# Altium schematic sheet CLK_INPUT.SchDoc: Clock distribution
size 420 x 297 mm; Author: G.K.; CompanyName: WUT; DrawnBy: G.K.; Organization: WUT ISE; Address1: Warsaw Univeristy of Technology; Address2: Nowowiejska 15/19; DocumentNumber: 6; Revision: -; SheetNumber: 6; SheetTotal: 7; EDA_Number: ARTIQ; Projet: ARTIQ/SINARA; ModifiedBy: -; CreateDate: XX/XX/XXXX; CheckedDate: -; Title2: and generation; DivGrp: ISE; Designer: G.K.; ModifiedDate: -; ProjectName: ARTIQ/SINARA
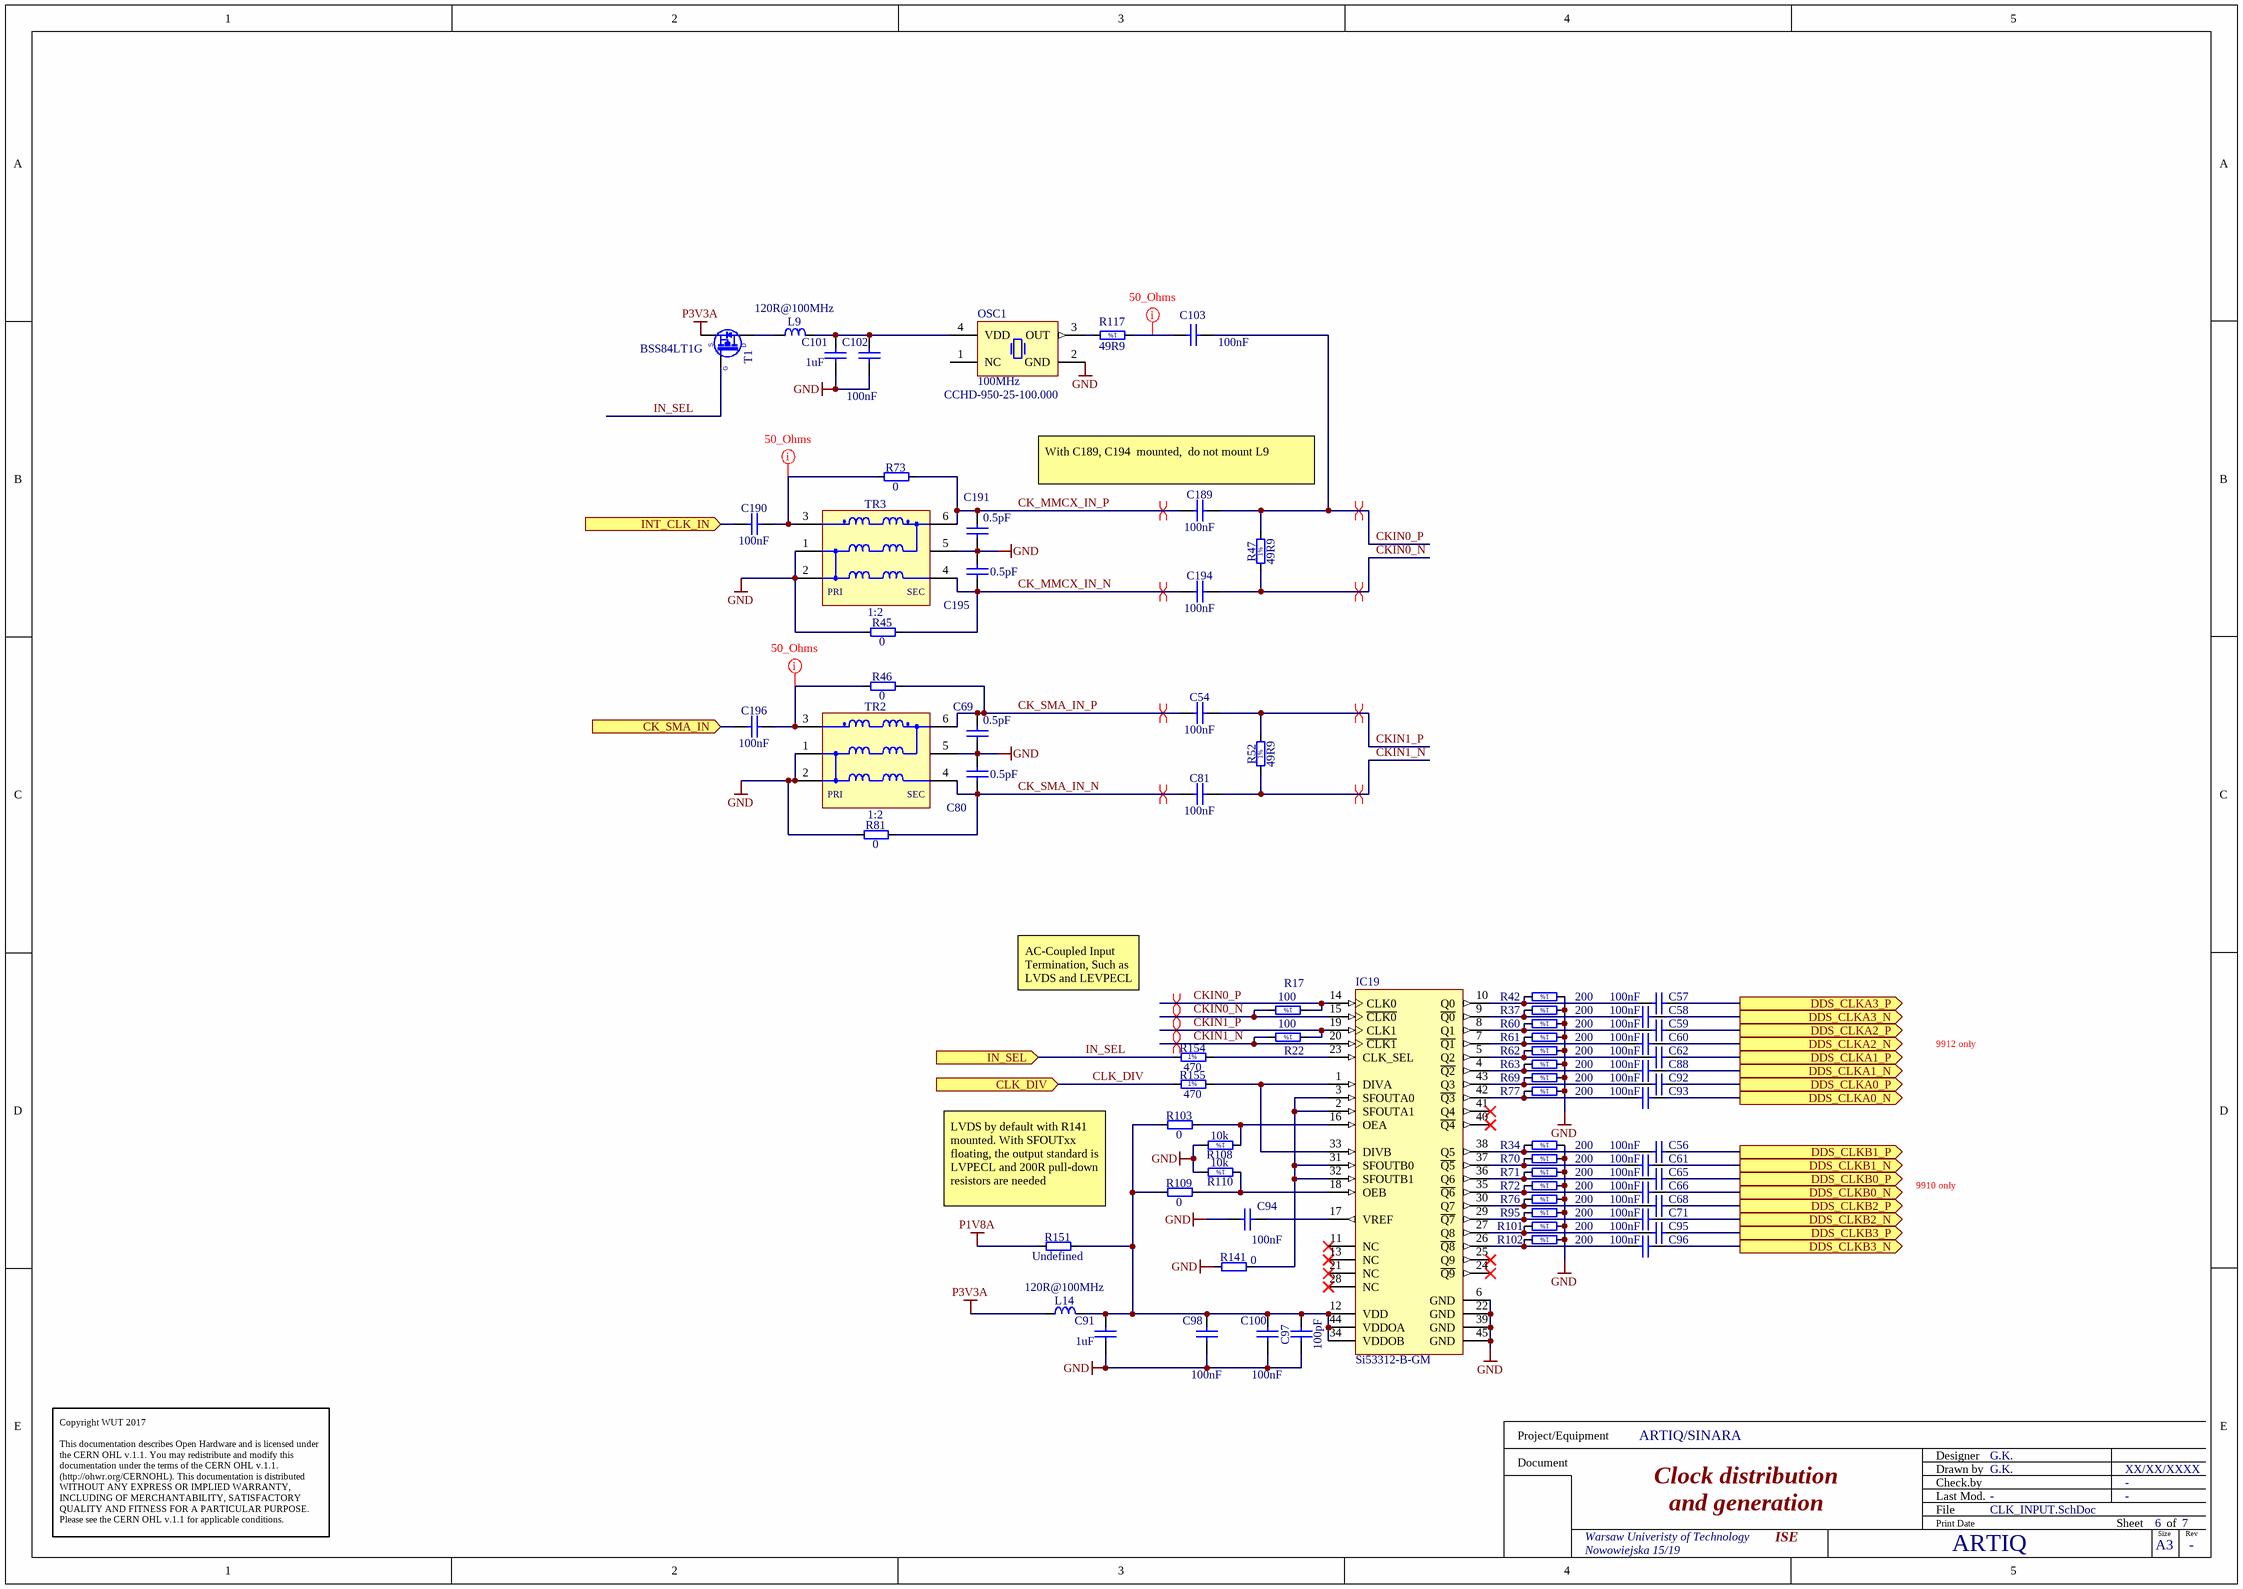
[diagram p0: CLK_INPUT.SchDoc]

## Parts
C54  100nF  [CAPC1005X55N]
C56  100nF  [CAPC1005X55N]
C57  100nF  [CAPC1005X55N]
C58  100nF  [CAPC1005X55N]
C59  100nF  [CAPC1005X55N]
C60  100nF  [CAPC1005X55N]
C61  100nF  [CAPC1005X55N]
C62  100nF  [CAPC1005X55N]
C65  100nF  [CAPC1005X55N]
C66  100nF  [CAPC1005X55N]
C68  100nF  [CAPC1005X55N]
C69  0.5pF  [CAPC1005X50N]
C71  100nF  [CAPC1005X55N]
C80  0.5pF  [CAPC1005X50N]
C81  100nF  [CAPC1005X55N]
C88  100nF  [CAPC1005X55N]
C91  1uF  [CAPC1005X55N]
C92  100nF  [CAPC1005X55N]
C93  100nF  [CAPC1005X55N]
C94  100nF  [CAPC1005X55N]
C95  100nF  [CAPC1005X55N]
C96  100nF  [CAPC1005X55N]
C97  100pF  [CAPC1005X55N]
C98  100nF  [CAPC1005X55N]
C100  100nF  [CAPC1005X55N]
C101  1uF  [CAPC1005X55N]
C102  100nF  [CAPC1005X55N]
C103  100nF  [CAPC1005X55N]
C189  100nF  [CAPC1005X55N]
C190  100nF  [CAPC1005X55N]
C191  0.5pF  [CAPC1005X50N]
C194  100nF  [CAPC1005X55N]
C195  0.5pF  [CAPC1005X50N]
C196  100nF  [CAPC1005X55N]
IC19  Si53312-B-GM  [SLAB-QFN-44-2800x2800TP_N]
L9  120R@100MHz  [INDC1608X95N]
L14  120R@100MHz  [INDC1608X95N]
OSC1  100MHz  Manufacturer Part Number: CCHD-950-25-100.000  [OSC_CRYSTEK_CCHD-950]
R17  100  [RESC1005X40N]
R22  100  [RESC1005X40N]
R34  200  [RESC1005X40N]
R37  200  [RESC1005X40N]
R42  200  [RESC1005X40N]
R45  0  [RESC1005X40N]
R46  0  [RESC1005X40N]
R47  49R9  [RESC1005X40N]
R52  49R9  [RESC1005X40N]
R60  200  [RESC1005X40N]
R61  200  [RESC1005X40N]
R62  200  [RESC1005X40N]
R63  200  [RESC1005X40N]
R69  200  [RESC1005X40N]
R70  200  [RESC1005X40N]
R71  200  [RESC1005X40N]
R72  200  [RESC1005X40N]
R73  0  [RESC1005X40N]
R76  200  [RESC1005X40N]
R77  200  [RESC1005X40N]
R81  0  [RESC1005X40N]
R95  200  [RESC1005X40N]
R101  200  [RESC1005X40N]
R102  200  [RESC1005X40N]
R103  0  [RESC1608X55N]
R108  10k  [RESC1005X40N]
R109  0  [RESC1608X55N]
R110  10k  [RESC1005X40N]
R117  49R9  [RESC1005X40N]
R141  0  [RESC1608X55N]
R151  Undefined  [RESC1608X55N]
R154  470  [RESC1005X40N]
R155  470  [RESC1005X40N]
T1  BSS84LT1G  [SOT95P240X110-3N]
TR2  1:2  [XFMR_MINI-CIRCUITS_DB1627]
TR3  1:2  [XFMR_MINI-CIRCUITS_DB1627]

## Ports
CK_SMA_IN (in), CLK_DIV (in), DDS_CLKA0_N (out), DDS_CLKA0_P (out), DDS_CLKA1_N (out), DDS_CLKA1_P (out), DDS_CLKA2_N (out), DDS_CLKA2_P (out), DDS_CLKA3_N (out), DDS_CLKA3_P (out), DDS_CLKB0_N (out), DDS_CLKB0_P (out), DDS_CLKB1_N (out), DDS_CLKB1_P (out), DDS_CLKB2_N (out), DDS_CLKB2_P (out), DDS_CLKB3_N (out), DDS_CLKB3_P (out), IN_SEL (in), INT_CLK_IN (in)

## Nets
GND: C69.1 C80.2 C91.1 C94.1 C97.1 C98.1 C100.1 C101.1 C102.1 C191.1 C195.2 IC19.6(GND) IC19.22(GND) IC19.39(GND) IC19.45(GND) OSC1.2(GND) R34.1 R37.1 R42.1 R45.1 R60.1 R61.1 R62.1 R63.1 R69.1 R70.1 R71.1 R72.1 R76.1 R77.1 R81.1 R95.1 R101.1 R102.1 R108.2 R110.2 R141.1 TR2.1(P1) TR2.2(P1) TR2.5(NC) TR3.1(P1) TR3.2(P1) TR3.5(NC)
P1V8A: R151.1
P3V3A: L14.2 T1.2(S)
CK_MMCX_IN_N: C194.1 C195.1 R45.2 TR3.4(S1)
CK_MMCX_IN_P: C189.1 C191.2 R73.2 TR3.6(S1)
CK_SMA_IN: C196.1 ; port CK_SMA_IN
CK_SMA_IN_N: C80.1 C81.1 R81.2 TR2.4(S1)
CK_SMA_IN_P: C54.1 C69.2 R46.2 TR2.6(S1)
CKIN0_N: C194.2 IC19.15(~{CLK0}) R17.2 R47.1
CKIN0_P: C103.1 C189.2 IC19.14(CLK0) R17.1 R47.2
CKIN1_N: C81.2 IC19.20(~{CLK1}) R22.2 R52.1
CKIN1_P: C54.2 IC19.19(CLK1) R22.1 R52.2
CLK_DIV: R155.1 ; port CLK_DIV
DDS_CLKA0_N: C93.1 ; port DDS_CLKA0_N
DDS_CLKA0_P: C92.1 ; port DDS_CLKA0_P
DDS_CLKA1_N: C88.1 ; port DDS_CLKA1_N
DDS_CLKA1_P: C62.1 ; port DDS_CLKA1_P
DDS_CLKA2_N: C60.1 ; port DDS_CLKA2_N
DDS_CLKA2_P: C59.1 ; port DDS_CLKA2_P
DDS_CLKA3_N: C58.1 ; port DDS_CLKA3_N
DDS_CLKA3_P: C57.1 ; port DDS_CLKA3_P
DDS_CLKB0_N: C66.1 ; port DDS_CLKB0_N
DDS_CLKB0_P: C65.1 ; port DDS_CLKB0_P
DDS_CLKB1_N: C61.1 ; port DDS_CLKB1_N
DDS_CLKB1_P: C56.1 ; port DDS_CLKB1_P
DDS_CLKB2_N: C71.1 ; port DDS_CLKB2_N
DDS_CLKB2_P: C68.1 ; port DDS_CLKB2_P
DDS_CLKB3_N: C96.1 ; port DDS_CLKB3_N
DDS_CLKB3_P: C95.1 ; port DDS_CLKB3_P
IN_SEL: R154.1 T1.1(G) ; port IN_SEL
INT_CLK_IN: C190.1 ; port INT_CLK_IN
NetC56_2: C56.2 IC19.38(Q5) R34.2
NetC57_2: C57.2 IC19.10(Q0) R42.2
NetC58_2: C58.2 IC19.9(~{Q0}) R37.2
NetC59_2: C59.2 IC19.8(Q1) R60.2
NetC60_2: C60.2 IC19.7(~{Q1}) R61.2
NetC61_2: C61.2 IC19.37(~{Q5}) R70.2
NetC62_2: C62.2 IC19.5(Q2) R62.2
NetC65_2: C65.2 IC19.36(Q6) R71.2
NetC66_2: C66.2 IC19.35(~{Q6}) R72.2
NetC68_2: C68.2 IC19.30(Q7) R76.2
NetC71_2: C71.2 IC19.29(~{Q7}) R95.2
NetC88_2: C88.2 IC19.4(~{Q2}) R63.2
NetC91_2: C91.2 C97.2 C98.2 C100.2 IC19.12(VDD) IC19.34(VDDOB) IC19.44(VDDOA) L14.1 R103.1 R109.1 R151.2
NetC92_2: C92.2 IC19.43(Q3) R69.2
NetC93_2: C93.2 IC19.42(~{Q3}) R77.2
NetC94_2: C94.2 IC19.17(VREF)
NetC95_2: C95.2 IC19.27(Q8) R101.2
NetC96_2: C96.2 IC19.26(~{Q8}) R102.2
NetC101_2: C101.2 C102.2 L9.1 OSC1.4(VDD)
NetC103_2: C103.2 R117.1
NetC190_2: C190.2 R73.1 TR3.3(P1)
NetC196_2: C196.2 R46.1 TR2.3(P1)
NetIC19_1: IC19.1(DIVA) IC19.33(DIVB) R155.2
NetIC19_2: IC19.2(SFOUTA1) IC19.3(SFOUTA0) IC19.31(SFOUTB0) IC19.32(SFOUTB1) R141.2
NetIC19_16: IC19.16(OEA) R103.2 R108.1
NetIC19_18: IC19.18(OEB) R109.2 R110.1
NetIC19_23: IC19.23(CLK_SEL) R154.2
NetL9_2: L9.2 T1.3(D)
NetOSC1_3: OSC1.3(OUT) R117.2

Not connected (* = marked no-connect by the designer): IC19 11(NC)* 13(NC)* 21(NC)* 24(~{Q9})* 25(Q9)* 28(NC)* 40(~{Q4})* 41(Q4)*; OSC1 1(NC)

## Layout directives
differential pair: CK_MMCX_IN_N, CK_MMCX_IN_P, CK_SMA_IN_N, CK_SMA_IN_P, CKIN0_N, CKIN0_P, CKIN1_N, CKIN1_P
net class 50_Ohms: NetC103_2, NetC190_2, NetC196_2

## Notes on the sheet
- (near C189) With C189, C194  mounted,  do not mount L9
- AC-Coupled Input Termination, Such as LVDS and LEVPECL
- 9912 only
- LVDS by default with R141 mounted. With SFOUTxx floating, the output standard is LVPECL and 200R pull-down resistors are needed
- 9910 only
- Copyright WUT 2017
  This documentation describes Open Hardware and is licensed under the CERN OHL v.1.1. You may redistribute and modify this documentation under the terms of the CERN OHL v.1.1. (http://ohwr.org/CERNOHL). This documentation is distributed WITHOUT ANY EXPRESS OR IMPLIED WARRANTY, INCLUDING OF MERCHANTABILITY, SATISFACTORY QUALITY AND FITNESS FOR A PARTICULAR PURPOSE. Please see the CERN OHL v.1.1 for applicable conditions.
- Project/Equipment
- Document
- Designer
- Drawn by
- Check.by
- File
- Last Mod.
- Print Date
- Sheet
- Size
- A3
- of
- Rev
- (in symbol R0402_10K_1%_0.0625W_100PPM) 1%
- (in symbol R0402_49R9_1%_0.0625W_100PPM) 1%
- (in symbol R0402_100R_1%_0.0625W_100PPM) 1%
- (in symbol R0402_200R_1%_0.0625W_100PPM) 1%
- (in symbol R0402_470R_1%_0.0625W_100PPM) 1%
- (in symbol XFMR_MINI-CIRCUITS_TCM2-43X+) PRI; SEC

## Library data of the parts
C54 C56-C62 C65 C66 C68 C71 C81 C88 C92-C96 C98 C100 C102 C103 C189 C190 C194 C196 = CC0402_100NF_16V_10%_X5R: Non-polarised capacitor; Part Description: SMD Multilayer Chip Ceramic Capacitor; Manufacturer: GENERIC; Manufacturer1 Part Number: GRM155R61C104KA88D; Voltage: 16V; TC: X5R; Tolerance: ±10%; Part Number: CC0402_100NF_16V_10%_X5R; Component Kind: Standard; Component Type: Standard; Pin Count: 2; Value: 100nF; Status: None; Manufacturer Part Number: CC0402_100NF_16V_10%_X5R; Case: 0402; Mounted: Yes; Socket: No; SMD: Yes; Sense: No; Manufacturer1 Example: MURATA; Manufacturer1 ComponentHeight: 0.55mm; HelpURL: \\cern.ch\dfs\Applications\Altium\Datasheets\CC0402_X5R_MURATA_GRM.pdf; Author: CERN DEM JLC; CreateDate: 10.12.2013; LatestRevisionDate: 10.12.2013
C69 C80 C191 C195 = CC0402_0.5PF_25V_0.05PF_AVX_04023J0R5ABSTR: Non-polarised capacitor; Part Description: Thin-Film Chip Capacitors for RF Signal and Power Applications, Accu-P Series; Manufacturer: AVX; Voltage: 25V; Tolerance: ±0.05pF; Part Number: CC0402_0.5PF_25V_0.05PF_AVX_04023J0R5ABSTR; Component Kind: Standard; Component Type: Standard; Pin Count: 2; Value: 0.5pF; Status: None; Manufacturer Part Number: 04023J0R5ABSTR; Case: 0402; Mounted: Yes; Socket: No; SMD: Yes; Sense: No; ComponentHeight: 0.5mm; HelpURL: \\cern.ch\dfs\Applications\Altium\Datasheets\CC0402_AVX_ACCU-P.pdf; Author: CERN DEM JLC; CreateDate: 2017-02-22; LatestRevisionDate: 2017-02-22
C91 C101 = CC0402_1UF_16V_10%_X5R: Non-polarised capacitor; Part Description: SMD Multilayer Chip Ceramic Capacitor; Manufacturer: GENERIC; Manufacturer1 Part Number: C1005X5R1C105KT; Voltage: 16V; TC: X5R; Tolerance: ±10%; Part Number: CC0402_1UF_16V_10%_X5R; Component Kind: Standard; Component Type: Standard; Pin Count: 2; Value: 1uF; Status: Preferred; Manufacturer Part Number: CC0402_1UF_16V_10%_X5R; Case: 0402; Mounted: Yes; Socket: No; SMD: Yes; Sense: No; Manufacturer1 Example: TDK; Manufacturer1 ComponentHeight: 0.55mm; HelpURL: \\cern.ch\dfs\Applications\Altium\Datasheets\CC0402_X5R_TDK_C.pdf; Author: CERN DEM JLC; CreateDate: 2012-10-25; LatestRevisionDate: 2012-10-25
C97 = CC0402_100PF_50V_5%_C0G: Non-polarised capacitor; Part Description: SMD Multilayer Chip Ceramic Capacitor; Manufacturer: GENERIC; Manufacturer1 Part Number: C0402C101J5GACTU; Voltage: 50V; TC: C0G/NP0; Tolerance: ±5%; Part Number: CC0402_100PF_50V_5%_C0G; Component Kind: Standard; Component Type: Standard; Pin Count: 2; Value: 100pF; Status: Preferred; Manufacturer Part Number: CC0402_100PF_50V_5%_C0G; Case: 0402; Mounted: Yes; Socket: No; SMD: Yes; Sense: No; Manufacturer1 Example: KEMET; Manufacturer1 ComponentHeight: 0.55mm; HelpURL: \\cern.ch\dfs\Applications\Altium\Datasheets\CC0805_C0G_KEMET_(Commercial Grade).pdf; Author: CERN DEM JLC; CreateDate: 03.12.2007; LatestRevisionDate: 22.04.2015
IC19 = CMP-0510-00356-1: 1:10 Low Jitter Universal Buffer / Level Translator with 2:1 Input Mux, 1 to 1250 MHz, -40 to 85 degC, 44-pin QFN; Manufacturer: Silicon Labs; Output Format: LVPECL; LVDS; CML; HCSL; LVCMOS; Sub-Family: Clock Buffers; PartNumber: Si53312-B-GM; ComponentLink2URL: http://www.silabs.com/Support%20Documents/TechnicalDocs/Si53312.pdf; ComponentLink1URL: http://www.silabs.com/; ComponentLink3URL: http://www.silabs.com/Support%20Documents/TechnicalDocs/Si53302.pdf; ComponentLink1Description: Manufacturer URL; Code_IPC: J-STD-020; Frequency (MHz): 1 to 1250; ComponentLink2Description: Datasheet; ComponentLink3Description: Package Specification; Code_JEDEC: MO-220; Mounting Technology: Surface Mount; PackageDescription: 44-Pin Quad-Flat No-Leads Package, Body 7 x 7 mm, Pitch 0.5 mm; DatasheetVersion: Rev. 0.4; PackageReference: QFN-44
L9 L14 = IND0603_MURATA_BLM18PG121SN1D: Inductor; Part Description: SMD EMIFIL Chip Ferrite Bead; Manufacturer: MURATA; Power: 2A; Resistance: 0.05R; Part Number: IND0603_MURATA_BLM18PG121SN1D; Component Kind: Standard; Component Type: Standard; Pin Count: 2; Value: 120R@100MHz; Status: None; Manufacturer Part Number: BLM18PG121SN1D; Case: 0603; Mounted: Yes; Socket: No; SMD: Yes; Sense: No; ComponentHeight: 0.95mm; HelpURL: \\cern.ch\dfs\Applications\Altium\Datasheets\IND0603_MURATA_BLM18P.pdf; Author: CERN DEM BC; CreateDate: 2015-07-27; LatestRevisionDate: 2015-07-27
OSC1 = OSC_CCHD-950: 100MHz low noise oscillator; Part Number: OSC_100MHZ_CRYSTEK_CCHD-950-25-100.000; Part Description: 3.3V, ±25ppm, 0..70°C, CMOS Surface Mount Ultra-Low Noise Oscillator (CCHD-950 Series); Manufacturer: CRYSTEK CRYSTAL; PressFit: No; Bonding: No; Component Kind: Standard; Component Type: Standard; PackageDescription: Oscillator, 5.08mm Pitch; 4 Pin, 14.2mm L X 9.14mm W X 5.3mm H, CCHD-950 Serie; Value: 100MHz; Pin Count: 4; Mounted: Yes; Socket: No; SMD: Yes; Sense: No; ComponentHeight: 5.3mm; HelpURL: \\cern.ch\dfs\Applications\Altium\Datasheets\OSC_CRYSTEK_CVHD-950.pdf; Author: GK; CreateDate: 04.11.2016; LatestRevisionDate: 04.11.2016
R17 R22 = R0402_100R_1%_0.0625W_100PPM: Resistor - 1%; Part Description: General Purpose Thick Film Chip Resistor; Manufacturer: GENERIC; Manufacturer1 Part Number: 232270671001L; TC: ±100ppm/°C; PressFit: No; Part Number: R0402_100R_1%_0.0625W_100PPM; Component Kind: Standard; Component Type: Standard; Pin Count: 2; Value: 100; Status: Not Recommended; Power: 0.0625W; Tolerance: ±1%; Manufacturer Part Number: R0402_100R_1%_0.0625W_100PPM; Case: 0402; Mounted: Yes; Sense: No; Socket: No; SMD: Yes; Manufacturer1 Example: YAGEO PHYCOMP; Manufacturer1 ComponentHeight: 0.4mm; HelpURL: \\cern.ch\dfs\Applications\Altium\Datasheets\R0402_Phycomp_RC0402.pdf; Author: CERN DEM JLC; CreateDate: 03.12.2007; LatestRevisionDate: 17.10.2012
R34 R37 R42 R60-R63 R69-R72 R76 R77 R95 R101 R102 = R0402_200R_1%_0.0625W_100PPM: Resistor - 1%; Part Description: General Purpose Thick Film Chip Resistor; Manufacturer: GENERIC; Manufacturer1 Part Number: 232270672001L; TC: ±100ppm/°C; PressFit: No; Part Number: R0402_200R_1%_0.0625W_100PPM; Component Kind: Standard; Component Type: Standard; Pin Count: 2; Value: 200; Status: Not Recommended; Power: 0.0625W; Tolerance: ±1%; Manufacturer Part Number: R0402_200R_1%_0.0625W_100PPM; Case: 0402; Mounted: Yes; Sense: No; Socket: No; SMD: Yes; Manufacturer1 Example: YAGEO PHYCOMP; Manufacturer1 ComponentHeight: 0.4mm; HelpURL: \\cern.ch\dfs\Applications\Altium\Datasheets\R0402_Phycomp_RC0402.pdf; Author: CERN DEM JLC; CreateDate: 03.12.2007; LatestRevisionDate: 17.10.2012
R45 R46 R73 R81 = R0402_0R_JUMPER: Resistor; Part Description: 1A (0.05R Max DC Resistance) Zero Ohm Jumper; Manufacturer: GENERIC; Manufacturer1 Part Number: 232270591001L; PressFit: No; Part Number: R0402_0R_JUMPER; Component Kind: Standard; Component Type: Standard; Pin Count: 2; Value: 0; Status: Not Recommended; Manufacturer Part Number: R0402_0R_JUMPER; Case: 0402; Mounted: Yes; Sense: No; Socket: No; SMD: Yes; Manufacturer1 Example: YAGEO PHYCOMP; Manufacturer1 ComponentHeight: 0.4mm; HelpURL: \\cern.ch\dfs\Applications\Altium\Datasheets\R0402_Phycomp_RC0402.pdf; Author: CERN DEM JLC; CreateDate: 03.12.2007; LatestRevisionDate: 17.10.2012
R47 R52 R117 = R0402_49R9_1%_0.0625W_100PPM: Resistor - 1%; Part Description: General Purpose Thick Film Chip Resistor; Manufacturer: GENERIC; Manufacturer1 Part Number: 232270674999L or RC0402FR-0749R9L; TC: ±100ppm/°C; PressFit: No; Part Number: R0402_49R9_1%_0.0625W_100PPM; Component Kind: Standard; Component Type: Standard; Pin Count: 2; Value: 49R9; Status: Not Recommended; Power: 0.0625W; Tolerance: ±1%; Manufacturer Part Number: R0402_49R9_1%_0.0625W_100PPM; Case: 0402; Mounted: Yes; Sense: No; Socket: No; SMD: Yes; Manufacturer1 Example: YAGEO PHYCOMP; Manufacturer1 ComponentHeight: 0.4mm; HelpURL: \\cern.ch\dfs\Applications\Altium\Datasheets\R0402_Phycomp_RC0402.pdf; Author: CERN DEM JLC; CreateDate: 24.10.2012; LatestRevisionDate: 24.10.2012
R103 R109 R141 = R0603_0R_JUMPER: Resistor; Part Description: 1A (0.05R Max DC Resistance) Zero Ohm Jumper; Manufacturer: GENERIC; Manufacturer1 Part Number: NRC06Z0; Part Number: R0603_0R_JUMPER; Component Kind: Standard; Component Type: Standard; Pin Count: 2; Value: 0; Status: Preferred; Manufacturer Part Number: R0603_0R_JUMPER; Case: 0603; Mounted: Yes; Sense: No; Socket: No; SMD: Yes; Manufacturer1 Example: NIC COMPONENT; Manufacturer1 ComponentHeight: 0.55mm; HelpURL: \\cern.ch\dfs\Applications\Altium\Datasheets\R0603_NIC_NRC.pdf; Author: CERN DEM JLC; CreateDate: 03.12.2007; LatestRevisionDate: 13.03.2008
R108 R110 = R0402_10K_1%_0.0625W_100PPM: Resistor - 1%; Part Description: General Purpose Thick Film Chip Resistor; Manufacturer: GENERIC; Manufacturer1 Part Number: 232270671003L; TC: ±100ppm/°C; Part Number: R0402_10K_1%_0.0625W_100PPM; Component Kind: Standard; Component Type: Standard; Pin Count: 2; Value: 10k; Status: Not recommended; Power: 0.0625W; Tolerance: ±1%; Manufacturer Part Number: R0402_10K_1%_0.0625W_100PPM; Case: 0402; Mounted: Yes; Sense: No; Socket: No; SMD: Yes; Manufacturer1 Example: YAGEO PHYCOMP; Manufacturer1 ComponentHeight: 0.4mm; HelpURL: \\cern.ch\dfs\Applications\Altium\Datasheets\R0402_Phycomp_RC0402.pdf; Author: CERN DEM JLC; CreateDate: 03.12.2007; LatestRevisionDate: 17.10.2012
R151 = R0603_NO-VALUE: Resistor; Part Description: Reserved Footprint For a 0603 (1608) Chip Resistor; PressFit: No; Mounted: No; Part Number: R0603_NO-VALUE; Component Kind: Standard; Component Type: Standard; Pin Count: 2; Value: Undefined; Status: None; Manufacturer: Undefined; Manufacturer Part Number: R0603_NO-VALUE; Case: 0603; Sense: No; Socket: No; SMD: Yes; Manufacturer1 Example: Undefined; Manufacturer1 Part Number: Undefined; Manufacturer1 ComponentHeight: Undefined; HelpURL: Undefined; Author: CERN DEM JLC; CreateDate: 03.12.2007; LatestRevisionDate: 13.03.2008
R154 R155 = R0402_470R_1%_0.0625W_100PPM: Resistor - 1%; Part Description: General Purpose Thick Film Chip Resistor; Manufacturer: GENERIC; Manufacturer1 Part Number: 232270674701L; TC: ±100ppm/°C; PressFit: No; Part Number: R0402_470R_1%_0.0625W_100PPM; Component Kind: Standard; Component Type: Standard; Pin Count: 2; Value: 470; Status: Not Recommended; Power: 0.0625W; Tolerance: ±1%; Manufacturer Part Number: R0402_470R_1%_0.0625W_100PPM; Case: 0402; Mounted: Yes; Sense: No; Socket: No; SMD: Yes; Manufacturer1 Example: YAGEO PHYCOMP; Manufacturer1 ComponentHeight: 0.4mm; HelpURL: \\cern.ch\dfs\Applications\Altium\Datasheets\R0402_Phycomp_RC0402.pdf; Author: CERN DEM JLC; CreateDate: 03.12.2007; LatestRevisionDate: 17.10.2012
T1 = BSS84LT1G: P-CHANNEL MOSFET WITH DIODE; Part Description: 50V 130mA Single P-Channel Power MOSFET; Manufacturer: ON SEMICONDUCTOR; PressFit: No; Bonding: No; Part Number: BSS84LT1G; Component Kind: Standard; Component Type: Standard; Device: BSS84LT1G; PackageDescription: SOT23 3-Leads, Pitch 0.95mm - Body 1.4x3mm, IPC Medium Density; Manufacturer Part Number: BSS84LT1G; Pin Count: 3; Case: SOT23-3; Mounted: Yes; Socket: No; SMD: Yes; Sense: No; ComponentHeight: 1.1mm; HelpURL: \\cern.ch\dfs\Applications\Altium\Datasheets\BSS84LT1G.pdf; Author: CERN DEM JLC; CreateDate: 29.03.2012; LatestRevisionDate: 29.03.2012
TR2 TR3 = XFMR_MINI-CIRCUITS_TCM2-43X+: 50 OHMS 10 to 4000 MHz RF Transformer; Power: 0.4W; Part Number: XFMR_MINI-CIRCUITS_TCM2-43X+; Component Kind: Standard; Component Type: Standard; Pin Count: 6; Value: 1:2; Status: None; Part Description: 50 Ohms 10 to 4000MHz RF Transformer; Manufacturer: MINI-CIRCUITS; Manufacturer Part Number: TCM2-43X+; Mounted: Yes; Socket: No; Sense: No; SMD: Yes; ComponentHeight: 4.06mm; HelpURL: \\cern.ch\dfs\Applications\Altium\Datasheets\XFMR_MINI-CIRCUITS_TCM2-43X+.pdf; Author: CERN DEM BC; CreateDate: 2016-02-12; LatestRevisionDate: 2016-02-12